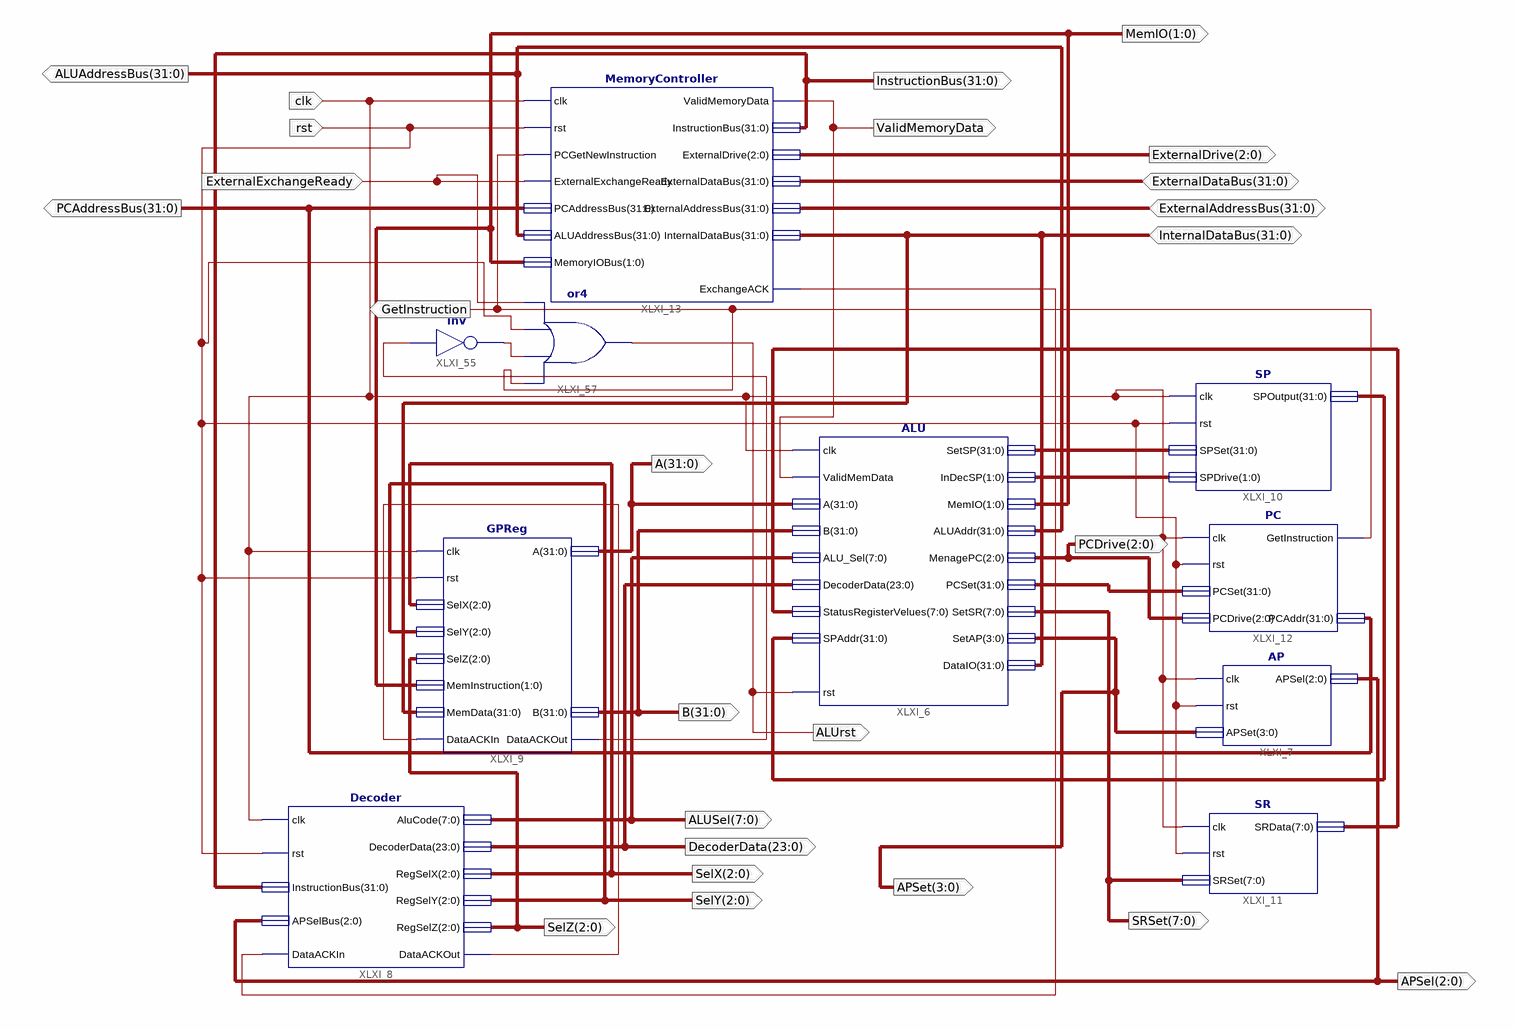
[diagram p0: schematic sheet 1]
// Xilinx ISE schematic MainCPU.sch (spartan6) as structural Verilog: 10 symbols, 26 ports
module MainCPU (
  input  clk,
  input  rst,
  input  ExternalExchangeReady,
  inout  [31:0] InternalDataBus,
  inout  [31:0] ExternalAddressBus,
  inout  [31:0] ExternalDataBus,
  output [31:0] B,
  output [7:0] ALUSel,
  output [2:0] SelX,
  output [2:0] SelY,
  output [2:0] SelZ,
  output [7:0] SRSet,
  output [3:0] APSet,
  output ValidMemoryData,
  output [31:0] InstructionBus,
  output [31:0] PCAddressBus,
  output GetInstruction,
  output [1:0] MemIO,
  output [2:0] ExternalDrive,
  output [31:0] ALUAddressBus,
  output [2:0] APSel,
  output [2:0] PCDrive,
  output [31:0] A,
  output [23:0] DecoderData,
  output ALUrst,
  output XLXN_280
);

  wire XLXN_278, XLXN_279, XLXN_284;
  wire [1:0] XLXN_18;
  wire [7:0] XLXN_16;
  wire [31:0] XLXN_13, XLXN_17, XLXN_20;

  ALU XLXI_6 (
    .clk(clk), .rst(ALUrst), .ValidMemData(ValidMemoryData), .A(A), .B(B), .ALU_Sel(ALUSel),
    .DecoderData(DecoderData), .StatusRegisterVelues(XLXN_16), .SPAddr(XLXN_20), .DataIO(InternalDataBus),
    .SetSP(XLXN_17), .InDecSP(XLXN_18), .MemIO(MemIO), .ALUAddr(ALUAddressBus), .MenagePC(PCDrive),
    .PCSet(XLXN_13), .SetSR(SRSet), .SetAP(APSet));
  GPReg XLXI_9 (
    .clk(clk), .rst(rst), .SelX(SelX), .SelY(SelY), .SelZ(SelZ), .MemInstruction(MemIO),
    .MemData(InternalDataBus), .A(A), .B(B), .DataACKIn(XLXN_279), .DataACKOut(XLXN_280));
  SP XLXI_10 (.clk(clk), .rst(rst), .SPSet(XLXN_17), .SPDrive(XLXN_18), .SPOutput(XLXN_20));
  SR XLXI_11 (.clk(clk), .rst(rst), .SRSet(SRSet), .SRData(XLXN_16));
  PC XLXI_12 (
    .clk(clk), .rst(rst), .PCSet(XLXN_13), .PCDrive(PCDrive), .GetInstruction(GetInstruction),
    .PCAddr(PCAddressBus));
  MemoryController XLXI_13 (
    .clk(clk), .rst(rst), .PCGetNewInstruction(GetInstruction),
    .ExternalExchangeReady(ExternalExchangeReady), .PCAddressBus(PCAddressBus),
    .ALUAddressBus(ALUAddressBus), .MemoryIOBus(MemIO), .ExternalDataBus(ExternalDataBus),
    .ExternalAddressBus(ExternalAddressBus), .InternalDataBus(InternalDataBus),
    .ValidMemoryData(ValidMemoryData), .InstructionBus(InstructionBus), .ExternalDrive(ExternalDrive),
    .ExchangeACK(XLXN_278));
  AP XLXI_7 (.clk(clk), .rst(rst), .APSet(APSet), .APSel(APSel));
  Decoder XLXI_8 (
    .clk(clk), .rst(rst), .InstructionBus(InstructionBus), .APSelBus(APSel), .AluCode(ALUSel),
    .DecoderData(DecoderData), .RegSelX(SelX), .RegSelY(SelY), .RegSelZ(SelZ), .DataACKIn(XLXN_278),
    .DataACKOut(XLXN_279));
  not XLXI_55 (XLXN_284, XLXN_280);
  or XLXI_57 (ALUrst, GetInstruction, XLXN_284, rst, ExternalExchangeReady);
endmodule
